# EAGLE schematic Belichter-Platinen (EAGLE 6.1)
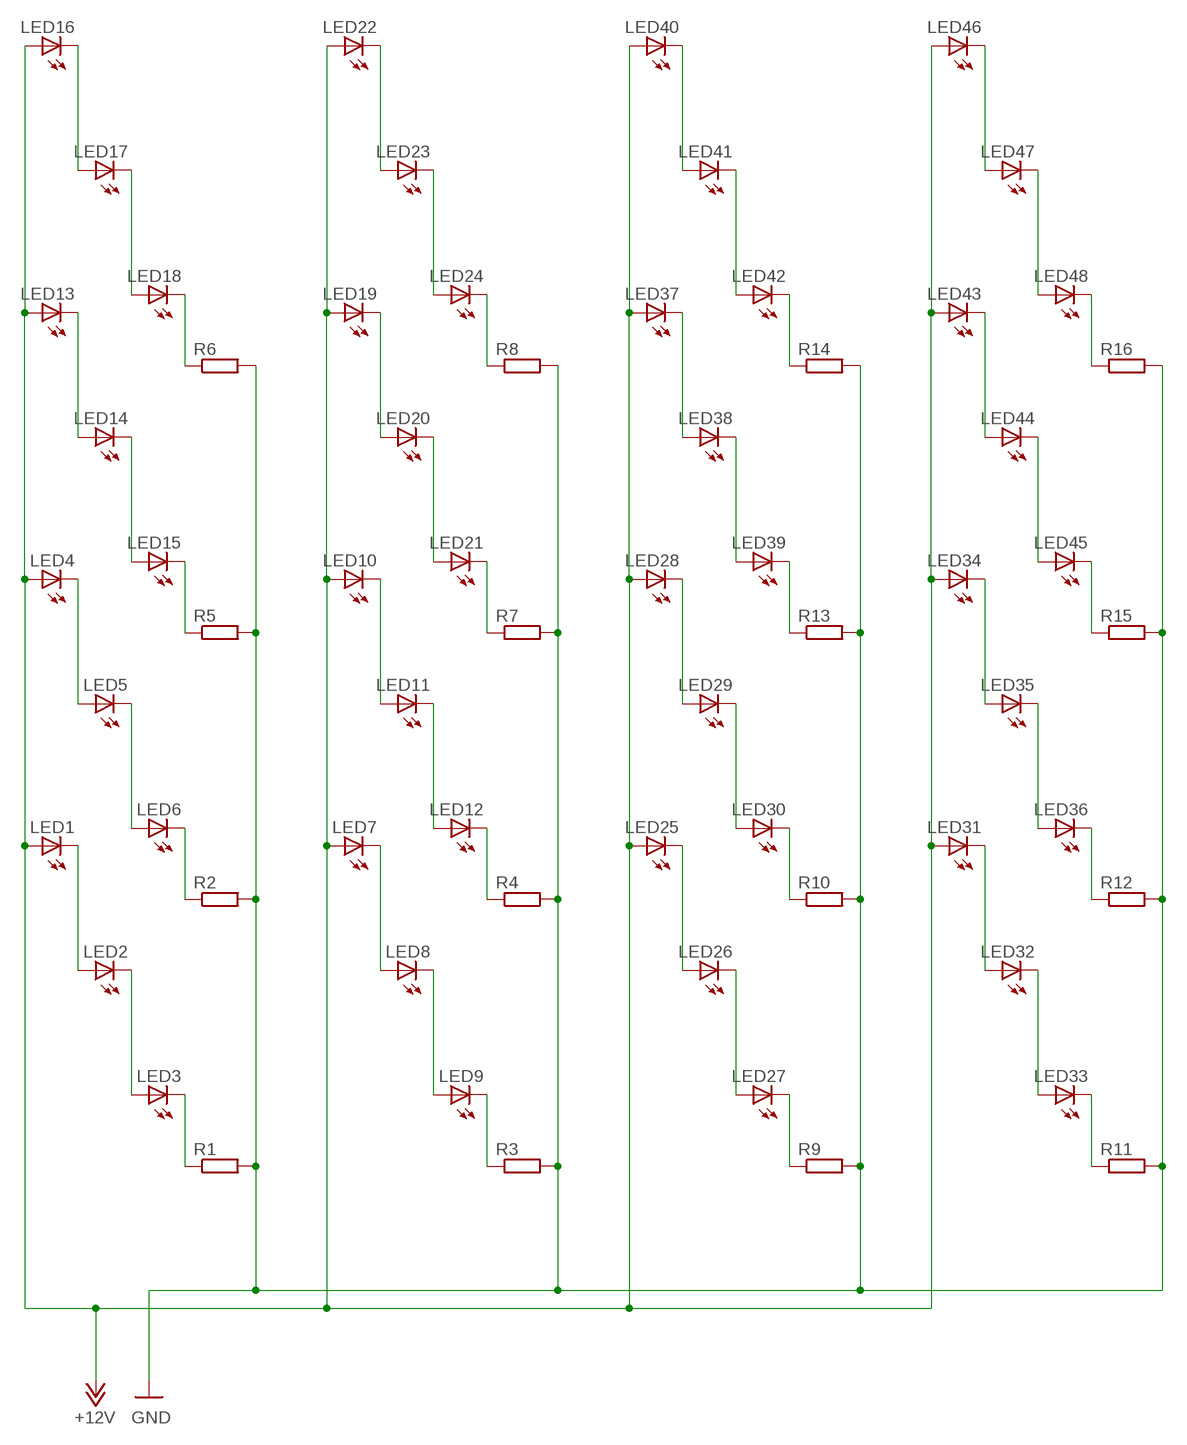
[diagram p0: schematic, sheet 1]

## Parts
LED1  LED5MM  [LED5MM]
LED2  LED5MM  [LED5MM]
LED3  LED5MM  [LED5MM]
LED4  LED5MM  [LED5MM]
LED5  LED5MM  [LED5MM]
LED6  LED5MM  [LED5MM]
LED7  LED5MM  [LED5MM]
LED8  LED5MM  [LED5MM]
LED9  LED5MM  [LED5MM]
LED10  LED5MM  [LED5MM]
LED11  LED5MM  [LED5MM]
LED12  LED5MM  [LED5MM]
LED13  LED5MM  [LED5MM]
LED14  LED5MM  [LED5MM]
LED15  LED5MM  [LED5MM]
LED16  LED5MM  [LED5MM]
LED17  LED5MM  [LED5MM]
LED18  LED5MM  [LED5MM]
LED19  LED5MM  [LED5MM]
LED20  LED5MM  [LED5MM]
LED21  LED5MM  [LED5MM]
LED22  LED5MM  [LED5MM]
LED23  LED5MM  [LED5MM]
LED24  LED5MM  [LED5MM]
LED25  LED5MM  [LED5MM]
LED26  LED5MM  [LED5MM]
LED27  LED5MM  [LED5MM]
LED28  LED5MM  [LED5MM]
LED29  LED5MM  [LED5MM]
LED30  LED5MM  [LED5MM]
LED31  LED5MM  [LED5MM]
LED32  LED5MM  [LED5MM]
LED33  LED5MM  [LED5MM]
LED34  LED5MM  [LED5MM]
LED35  LED5MM  [LED5MM]
LED36  LED5MM  [LED5MM]
LED37  LED5MM  [LED5MM]
LED38  LED5MM  [LED5MM]
LED39  LED5MM  [LED5MM]
LED40  LED5MM  [LED5MM]
LED41  LED5MM  [LED5MM]
LED42  LED5MM  [LED5MM]
LED43  LED5MM  [LED5MM]
LED44  LED5MM  [LED5MM]
LED45  LED5MM  [LED5MM]
LED46  LED5MM  [LED5MM]
LED47  LED5MM  [LED5MM]
LED48  LED5MM  [LED5MM]
R1  R-EU_0207/10  [0207/10]
R2  R-EU_0207/10  [0207/10]
R3  R-EU_0207/10  [0207/10]
R4  R-EU_0207/10  [0207/10]
R5  R-EU_0207/10  [0207/10]
R6  R-EU_0207/10  [0207/10]
R7  R-EU_0207/10  [0207/10]
R8  R-EU_0207/10  [0207/10]
R9  R-EU_0207/10  [0207/10]
R10  R-EU_0207/10  [0207/10]
R11  R-EU_0207/10  [0207/10]
R12  R-EU_0207/10  [0207/10]
R13  R-EU_0207/10  [0207/10]
R14  R-EU_0207/10  [0207/10]
R15  R-EU_0207/10  [0207/10]
R16  R-EU_0207/10  [0207/10]

## Nets
+12V: LED1.A LED4.A LED7.A LED10.A LED13.A LED16.A LED19.A LED22.A LED25.A LED28.A LED31.A LED34.A LED37.A LED40.A LED43.A LED46.A
GND: R1.2 R2.2 R3.2 R4.2 R5.2 R6.2 R7.2 R8.2 R9.2 R10.2 R11.2 R12.2 R13.2 R14.2 R15.2 R16.2
N$1: LED13.K(C) LED14.A
N$2: LED1.K(C) LED2.A
N$3: LED2.K(C) LED3.A
N$4: LED3.K(C) R1.1
N$5: LED14.K(C) LED15.A
N$6: LED7.K(C) LED8.A
N$7: LED4.K(C) LED5.A
N$8: LED5.K(C) LED6.A
N$9: LED6.K(C) R2.1
N$10: LED15.K(C) R5.1
N$11: LED8.K(C) LED9.A
N$12: LED9.K(C) R3.1
N$13: LED10.K(C) LED11.A
N$14: LED11.K(C) LED12.A
N$15: LED12.K(C) R4.1
N$16: LED16.K(C) LED17.A
N$17: LED17.K(C) LED18.A
N$18: LED18.K(C) R6.1
N$19: LED19.K(C) LED20.A
N$20: LED20.K(C) LED21.A
N$21: LED21.K(C) R7.1
N$22: LED22.K(C) LED23.A
N$23: LED23.K(C) LED24.A
N$24: LED24.K(C) R8.1
N$25: LED25.K(C) LED26.A
N$26: LED26.K(C) LED27.A
N$27: LED27.K(C) R9.1
N$28: LED28.K(C) LED29.A
N$29: LED29.K(C) LED30.A
N$30: LED30.K(C) R10.1
N$31: LED31.K(C) LED32.A
N$32: LED32.K(C) LED33.A
N$33: LED33.K(C) R11.1
N$34: LED34.K(C) LED35.A
N$35: LED35.K(C) LED36.A
N$36: LED36.K(C) R12.1
N$37: LED37.K(C) LED38.A
N$38: LED38.K(C) LED39.A
N$39: LED39.K(C) R13.1
N$40: LED40.K(C) LED41.A
N$41: LED41.K(C) LED42.A
N$42: LED42.K(C) R14.1
N$43: LED43.K(C) LED44.A
N$44: LED44.K(C) LED45.A
N$45: LED45.K(C) R15.1
N$46: LED46.K(C) LED47.A
N$47: LED47.K(C) LED48.A
N$48: LED48.K(C) R16.1

## Library data of the parts
LED1-LED48 = led:LED: LED OSRAM: - CHIPLED LG R971, LG N971, LY N971, LG Q971, LY Q971, LO R971, LY R971 LH N974, LH R974 LS Q976, LO Q976, LY Q976 LO Q996 - Hyper CHIPLED LW Q18S LB Q993, LB Q99A, LB R99A - SideLED LS A670, LO A670, LY A670, LG A670, LP A670 LB A673, LV A673, LT A673, LW A673 LH A674 LY A675 LS A676, LA A676, LO A676, LY A676, LW A676 LS A679, LY A679, LG A679 - Hyper Micro SIDELED® LS Y876, LA Y876, LO Y876, LY Y876 LT Y87S - SmartLED LW L88C, LW L88S LB L89C, LB L89S, LG L890 LS L89K, LO L89K, LY L89K LS L896, LA L896, LO L896, LY L896 - TOPLED LS T670, LO T670, LY T670, LG T670, LP T670 LSG T670, LSP T670, LSY T670, LOP T670, LYG T670 LG T671, LOG T671, LSG T671 LB T673, LV T673, LT T673, LW T673 LH T674 LS T676, LA T676, LO T676, LY T676, LB T676, LH T676, LSB T676, LW T676 LB T67C, LV T67C, LT T67C, LS T67K, LO T67K, LY T67K, LW E67C LS E67B, LA E67B, LO E67B, LY E67B, LB E67C, LV E67C, LT E67C LW T67C LS T679, LY T679, LG T679 LS T770, LO T770, LY T770, LG T770, LP T770 LB T773, LV T773, LT T773, LW T773 LH T774 LS E675, LA E675, LY E675, LS T675 LS T776, LA T776, LO T776, LY T776, LB T776 LHGB T686 LT T68C, LB T68C - Hyper Mini TOPLED® LB M676 - Mini TOPLED Santana® LG M470 LS M47K, LO M47K, LY M47K Source: http://www.osram.convergy.de LUXEON: - LUMILED® LXK2-PW12-R00, LXK2-PW12-S00, LXK2-PW14-U00, LXK2-PW14-V00 LXK2-PM12-R00, LXK2-PM12-S00, LXK2-PM14-U00 LXK2-PE12-Q00, LXK2-PE12-R00, LXK2-PE12-S00, LXK2-PE14-T00, LXK2-PE14-U00 LXK2-PB12-K00, LXK2-PB12-L00, LXK2-PB12-M00, LXK2-PB14-N00, LXK2-PB14-P00, LXK2-PB14-Q00 LXK2-PR12-L00, LXK2-PR12-M00, LXK2-PR14-Q00, LXK2-PR14-R00 LXK2-PD12-Q00, LXK2-PD12-R00, LXK2-PD12-S00 LXK2-PH12-R00, LXK2-PH12-S00 LXK2-PL12-P00, LXK2-PL12-Q00, LXK2-PL12-R00 Source: www.luxeon.com KINGBRIGHT: KA-3528ASYC Source: www.kingbright.com
R1-R16 = rcl:R-EU_: RESISTOR, European symbol